# Altium project Plastic_keyboard_IDC10.PrjPcb
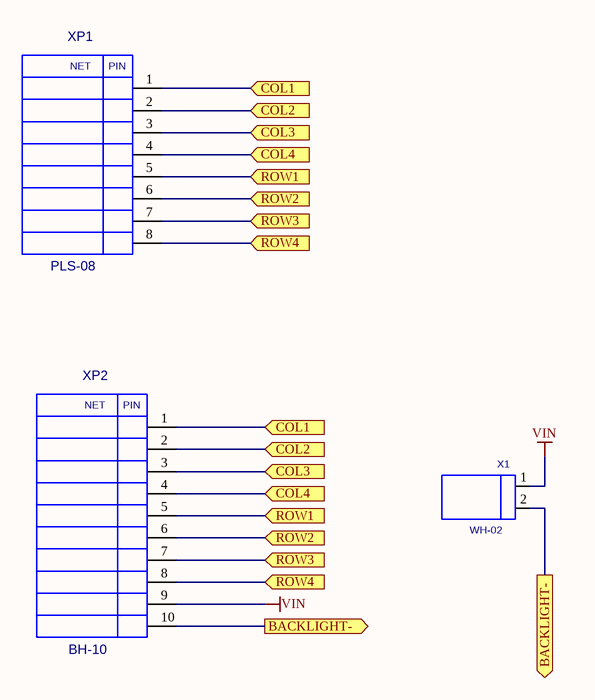
[diagram p0: Main.SchDoc]
1 sheet, 3 parts. Net scope: flat (ports and power ports of the same name join across sheets).
Board file: Plastic_keyboard_IDC10.PcbDoc

## Sheet Main.SchDoc
size A4

### Parts
X1  WH-02  [WH-02]
XP1  PLS-08  [PLS-08]
XP2  BH-10  [BH-10]

### Ports
BACKLIGHT- (out), COL1 (in), COL2 (in), COL3 (in), COL4 (in), ROW1 (in), ROW2 (in), ROW3 (in), ROW4 (in)

### Nets
VIN: X1.1 XP2.9
NetX1_2: X1.2 XP2.10 ; port BACKLIGHT-
NetXP1_1: XP1.1 XP2.1 ; port COL1
NetXP1_2: XP1.2 XP2.2 ; port COL2
NetXP1_3: XP1.3 XP2.3 ; port COL3
NetXP1_4: XP1.4 XP2.4 ; port COL4
NetXP1_5: XP1.5 XP2.5 ; port ROW1
NetXP1_6: XP1.6 XP2.6 ; port ROW2
NetXP1_7: XP1.7 XP2.7 ; port ROW3
NetXP1_8: XP1.8 XP2.8 ; port ROW4

### Notes on the sheet
- (in symbol BH-10) NET; PIN
- (in symbol PLS-08) NET; PIN

### Library data of the parts
X1 = WH-02: Value: *
XP1 = PLS-08: Value: *
XP2 = BH-10: Value: *